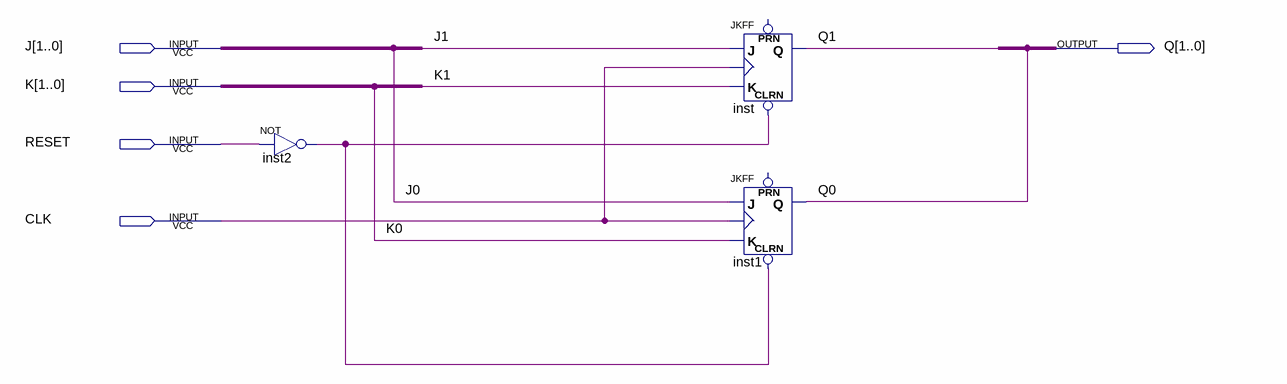
[diagram p0: schematic sheet]
// Quartus schematic REGISTER.bdf as structural Verilog: 3 symbols, 5 pins
module REGISTER (
  input  [1:0] J,
  input  [1:0] K,
  input  RESET,
  input  CLK,
  output [1:0] Q
);

  wire inst2_out;

  not inst2 (inst2_out, RESET);
  JKFF inst (.CLRN(inst2_out), .K(K[1]), .J(J[1]), .CLK(CLK), .Q(Q[1]));  // open: PRN
  JKFF inst1 (.CLRN(inst2_out), .K(K[0]), .J(J[0]), .CLK(CLK), .Q(Q[0]));  // open: PRN
endmodule
